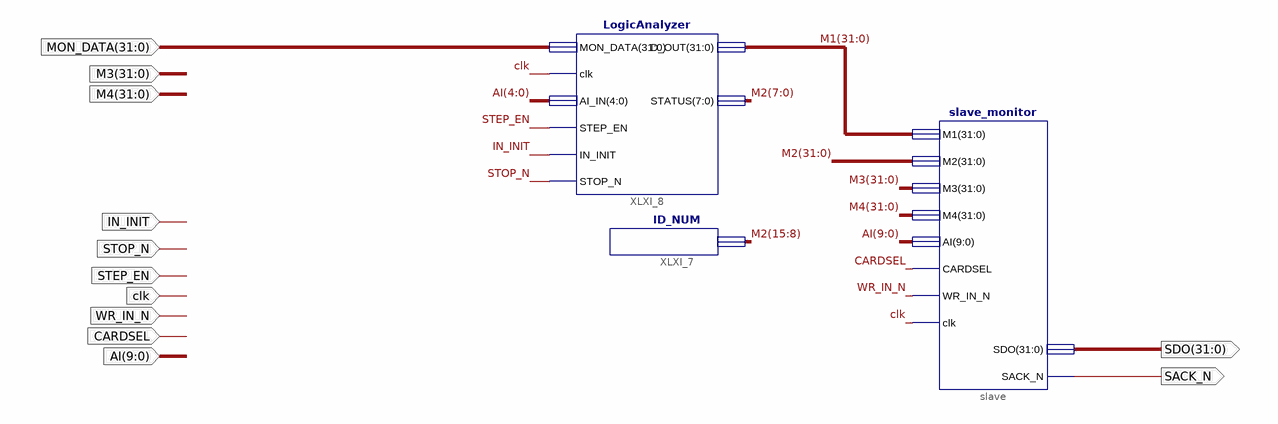
[diagram p0: schematic sheet 1]
// Xilinx ISE schematic SlaveMonitor.sch (spartan6) as structural Verilog: 3 symbols, 12 ports
module SlaveMonitor (
  input  clk,
  input  [9:0] AI,
  input  [31:0] M3,
  input  [31:0] M4,
  input  WR_IN_N,
  input  CARDSEL,
  input  STEP_EN,
  input  IN_INIT,
  input  [31:0] MON_DATA,
  input  STOP_N,
  output SACK_N,
  output [31:0] SDO
);

  wire [31:0] M1, M2;

  ID_NUM XLXI_7 (.ID(M2[15:8]));
  slave_monitor slave (
    .M1(M1), .M2(M2), .M3(M3), .M4(M4), .AI(AI), .CARDSEL(CARDSEL), .WR_IN_N(WR_IN_N), .clk(clk), .SDO(SDO),
    .SACK_N(SACK_N));
  LogicAnalyzer XLXI_8 (
    .MON_DATA(MON_DATA), .clk(clk), .STEP_EN(STEP_EN), .AI_IN(AI[4:0]), .D_OUT(M1), .STATUS(M2[7:0]),
    .IN_INIT(IN_INIT), .STOP_N(STOP_N));
endmodule
